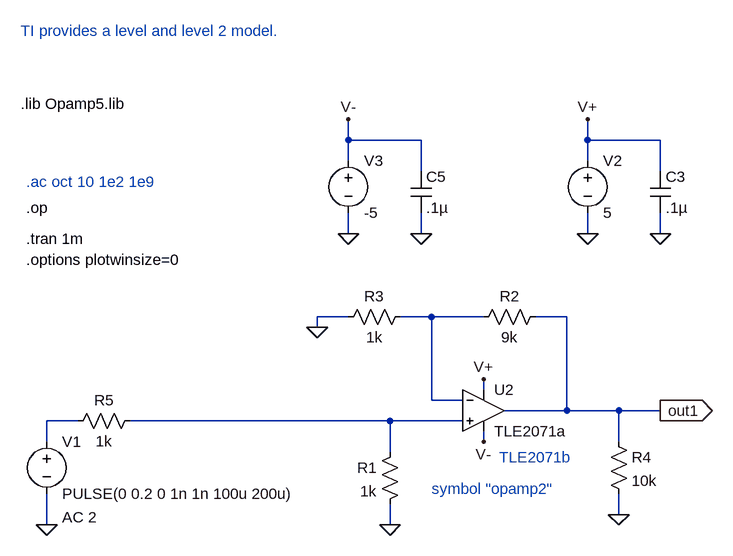
[diagram p0: schematic TLE2071_test.asc]
TLE2071_test.asc, the LTspice schematic file:
Version 4
SHEET 1 1580 2296
WIRE 288 -144 288 -176
WIRE 400 -144 288 -144
WIRE 656 -144 656 -176
WIRE 768 -144 656 -144
WIRE 288 -112 288 -144
WIRE 656 -112 656 -144
WIRE 400 -96 400 -144
WIRE 768 -96 768 -144
WIRE 288 0 288 -32
WIRE 400 0 400 -32
WIRE 656 0 656 -32
WIRE 768 0 768 -32
WIRE 288 128 240 128
WIRE 416 128 368 128
WIRE 496 128 416 128
WIRE 624 128 576 128
WIRE 240 144 240 128
WIRE 496 240 496 224
WIRE 416 256 416 128
WIRE 464 256 416 256
WIRE 624 272 624 128
WIRE 624 272 528 272
WIRE 704 272 624 272
WIRE 768 272 704 272
WIRE -128 288 -176 288
WIRE 352 288 -48 288
WIRE 464 288 352 288
WIRE -176 320 -176 288
WIRE 496 320 496 304
WIRE 704 320 704 272
WIRE 352 336 352 288
WIRE 704 432 704 400
WIRE -176 448 -176 400
WIRE 352 448 352 416
FLAG -176 448 0
FLAG 352 448 0
FLAG 496 320 V-
FLAG 496 224 V+
FLAG 240 144 0
FLAG 704 432 0
FLAG 656 0 0
FLAG 288 -176 V-
FLAG 288 0 0
FLAG 656 -176 V+
FLAG 768 0 0
FLAG 400 0 0
FLAG 768 272 out1
IOPIN 768 272 Out
SYMBOL voltage -176 304 R0
WINDOW 123 24 132 Left 0
WINDOW 39 0 0 Left 0
SYMATTR Value2 AC 2
SYMATTR InstName V1
SYMATTR Value PULSE(0 0.2 0 1n 1n 100u 200u)
SYMBOL RES 368 320 M0
SYMATTR InstName R1
SYMATTR Value 1k
SYMBOL res 480 144 R270
WINDOW 0 32 56 VTop 0
WINDOW 3 0 56 VBottom 0
SYMATTR InstName R2
SYMATTR Value 9k
SYMBOL res 272 144 R270
WINDOW 0 32 56 VTop 0
WINDOW 3 0 56 VBottom 0
SYMATTR InstName R3
SYMATTR Value 1k
SYMBOL res 688 304 R0
SYMATTR InstName R4
SYMATTR Value 10k
SYMBOL VOLTAGE 656 -128 R0
WINDOW 123 0 0 Left 0
WINDOW 39 0 0 Left 0
SYMATTR InstName V2
SYMATTR Value 5
SYMBOL VOLTAGE 288 -128 R0
WINDOW 39 0 0 Left 0
WINDOW 123 0 0 Left 0
SYMATTR InstName V3
SYMATTR Value -5
SYMBOL cap 752 -96 R0
SYMATTR InstName C3
SYMATTR Value .1µ
SYMBOL cap 384 -96 R0
SYMATTR InstName C5
SYMATTR Value .1µ
SYMBOL Opamps\\opamp2 496 208 R0
SYMATTR InstName U2
SYMATTR Value TLE2071a
SYMBOL res -144 304 R270
WINDOW 0 32 56 VTop 0
WINDOW 3 0 56 VBottom 0
SYMATTR InstName R5
SYMATTR Value 1k
TEXT -208 -80 Left 0 ;.ac oct 10 1e2 1e9
TEXT -216 -200 Left 0 !.lib Opamp5.lib
TEXT -208 -40 Left 0 !.op
TEXT -208 8 Left 0 !.tran 1m
TEXT -208 40 Left 0 !.options plotwinsize=0
TEXT -216 -312 Left 0 ;TI provides a level and level 2 model.
TEXT 416 392 Left 0 ;symbol "opamp2"
TEXT 520 344 Left 0 ;TLE2071b

The netlist it stands for:
* TLE2071_test.asc
V1 N002 0 PULSE(0 0.2 0 1n 1n 100u 200u) AC 2
R1 N003 0 1k
R2 N001 out1 9k
R3 0 N001 1k
R4 out1 0 10k
V2 V+ 0 5
V3 V- 0 -5
C3 V+ 0 .1µ
C5 V- 0 .1µ
XU2 N003 N001 V+ V- out1 TLE2071a  ; pins In+ In- V+ V- OUT
R5 N002 N003 1k
* .ac oct 10 1e2 1e9
.lib Opamp5.lib
.op
.tran 1m
.options plotwinsize=0
* TI provides a level and level 2 model.
* symbol "opamp2"
* TLE2071b
.backanno
.end